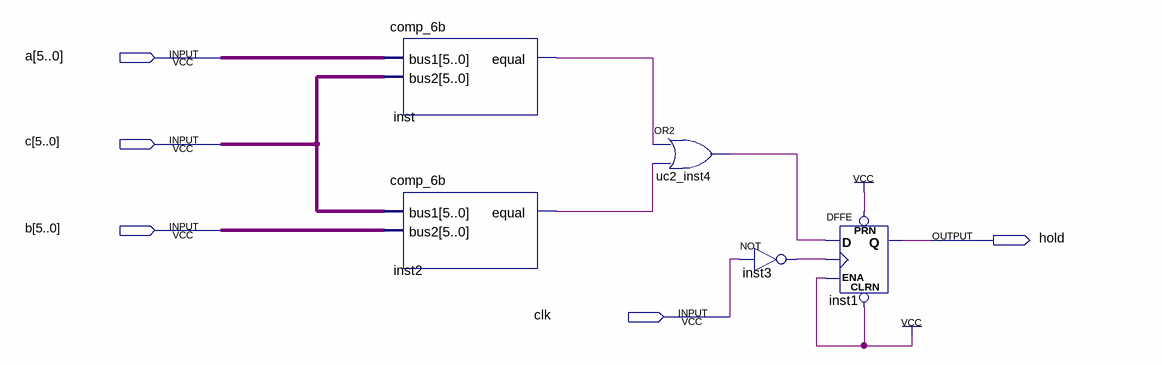
[diagram p0: schematic sheet]
// Quartus schematic uc_2.bdf as structural Verilog: 5 symbols, 5 pins
module uc_2 (
  input  [5:0] a,
  input  [5:0] c,
  input  [5:0] b,
  input  clk,
  output hold
);

  wire inst2_equal, inst3_out, inst_equal, uc2_inst4_out;

  comp_6b inst (.bus1(a), .bus2(c), .equal(inst_equal));
  comp_6b inst2 (.bus1(c), .bus2(b), .equal(inst2_equal));
  or uc2_inst4 (uc2_inst4_out, inst_equal, inst2_equal);
  not inst3 (inst3_out, clk);
  DFFE inst1 (.PRN(1'b1), .CLRN(1'b1), .D(uc2_inst4_out), .CLK(inst3_out), .ENA(1'b1), .Q(hold));
endmodule
